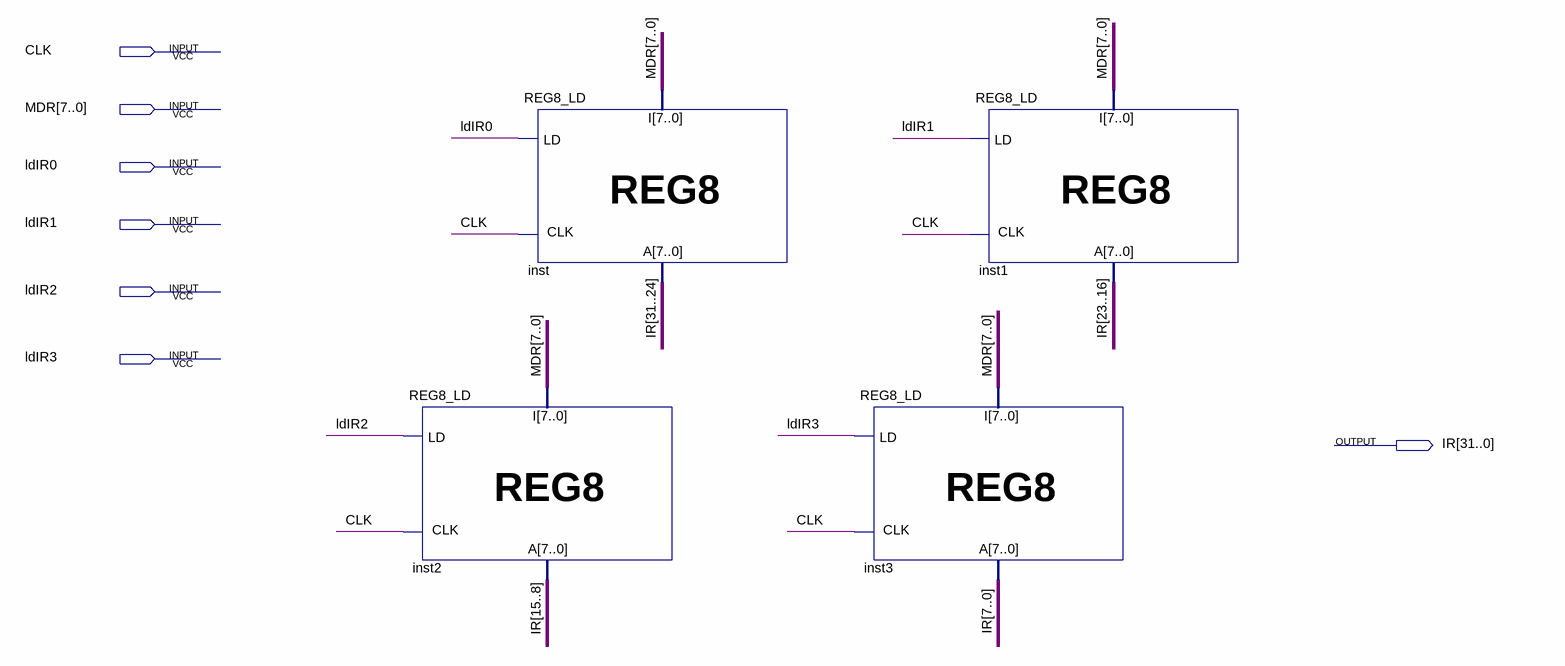
[diagram p0: schematic sheet]
// Quartus schematic IR_REG.bdf as structural Verilog: 4 symbols, 7 pins
module IR_REG (
  input  CLK,
  input  [7:0] MDR,
  input  ldIR0,
  input  ldIR1,
  input  ldIR2,
  input  ldIR3,
  output [31:0] IR
);

  REG8_LD inst2 (.I(MDR), .CLK(CLK), .LD(ldIR2), .A(IR[15:8]));
  REG8_LD inst (.I(MDR), .CLK(CLK), .LD(ldIR0), .A(IR[31:24]));
  REG8_LD inst3 (.I(MDR), .CLK(CLK), .LD(ldIR3), .A(IR[7:0]));
  REG8_LD inst1 (.I(MDR), .CLK(CLK), .LD(ldIR1), .A(IR[23:16]));
endmodule
